# EAGLE design fr5949_v3 (EAGLE 8.1.0)
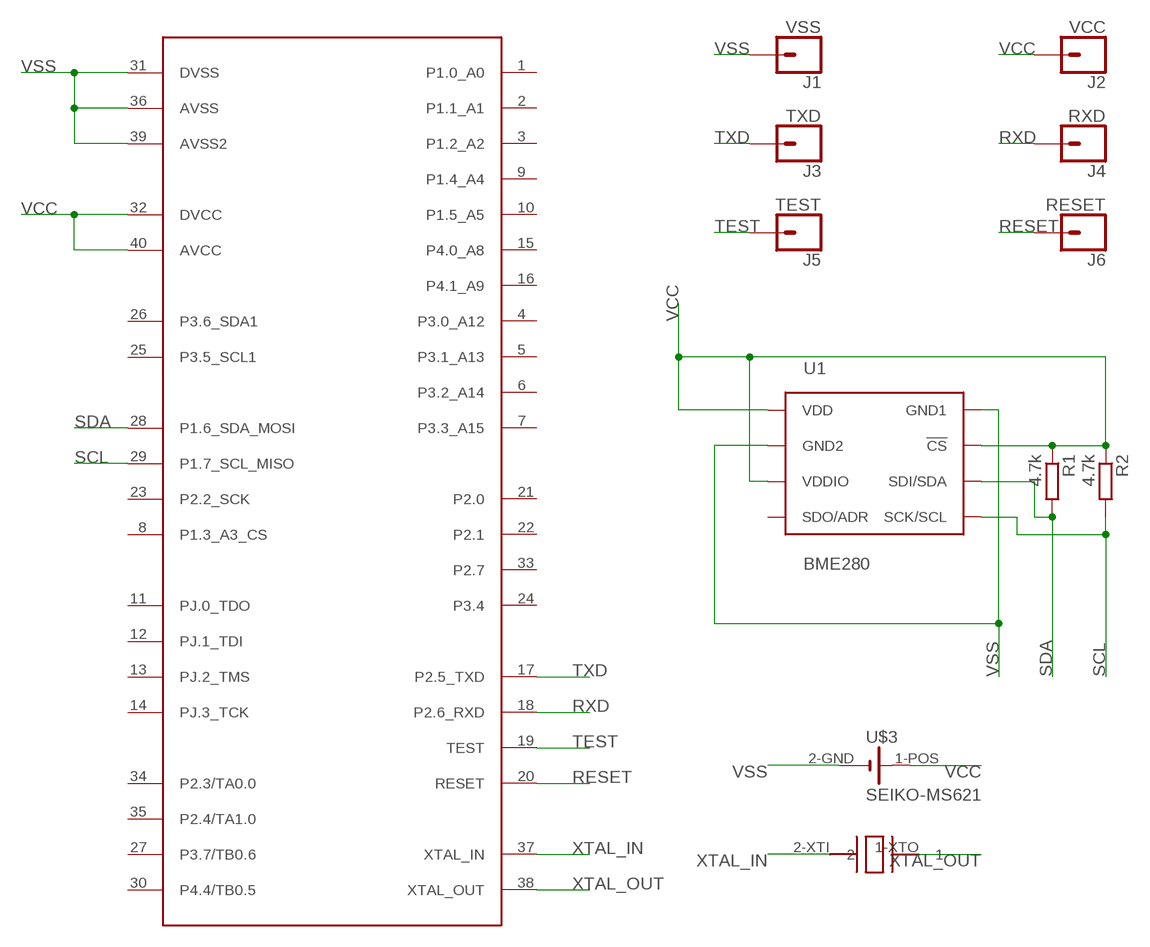
[diagram p0: schematic, sheet 1]

## Parts
J1  VSS  CONN_01  [1X01]
J2  VCC  CONN_01  [1X01]
J3  TXD  CONN_01  [1X01]
J4  RXD  CONN_01  [1X01]
J5  TEST  CONN_01  [1X01]
J6  RESET  CONN_01  [1X01]
R1  4.7k  R-EU_R0201  [R0201]
R2  4.7k  R-EU_R0201  [R0201]
U1  BME280  [BME280_LGA]
U$1  MSP430FR5949_RHA  [RHA-40-VQFN]
U$2  ABS06  [2.0X1.0RTC]
U$3  SEIKO-MS621  [SEIKO_MICRO]

## Nets
RESET: J6.1 U$1.20(RESET)
RXD: J4.1 U$1.18(P2.6_RXD)
SCL: R2.2 U1.P$4(SCK/SCL) U$1.29(P1.7_SCL_MISO)
SDA: R1.2 U1.P$3(SDI/SDA) U$1.28(P1.6_SDA_MOSI)
TEST: J5.1 U$1.19(TEST)
TXD: J3.1 U$1.17(P2.5_TXD)
VCC: J2.1 R1.1 R2.1 U1.P$2(!CS) U1.P$6(VDDIO) U1.P$8(VDD) U$1.32(DVCC) U$1.40(AVCC) U$3.1-POS(+)
VSS: J1.1 U1.P$1(GND1) U1.P$7(GND2) U$1.31(DVSS) U$1.36(AVSS) U$1.39(AVSS2) U$3.2-GND(-)
XTAL_IN: U$1.37(XTAL_IN) U$2.2-XTI
XTAL_OUT: U$1.38(XTAL_OUT) U$2.1-XTO
Unconnected: U1.P$5(SDO/ADR) U$1.1(P1.0_A0) U$1.2(P1.1_A1) U$1.3(P1.2_A2) U$1.4(P3.0_A12) U$1.5(P3.1_A13) U$1.6(P3.2_A14) U$1.7(P3.3_A15) U$1.8(P1.3_A3_CS) U$1.9(P1.4_A4) U$1.10(P1.5_A5) U$1.11(PJ.0_TDO) U$1.12(PJ.1_TDI) U$1.13(PJ.2_TMS) U$1.14(PJ.3_TCK) U$1.15(P4.0_A8) U$1.16(P4.1_A9) U$1.21(P2.0) U$1.22(P2.1) U$1.23(P2.2_SCK) U$1.24(P3.4) U$1.25(P3.5_SCL1) U$1.26(P3.6_SDA1) U$1.27(P3.7/TB0.6) U$1.30(P4.4/TB0.5) U$1.33(P2.7) U$1.34(P2.3/TA0.0) U$1.35(P2.4/TA1.0)

## Library data of the parts
J1-J6 = SparkFun-Connectors:CONN_01: Single connection point. Often used as Generic Header-pin footprint for 0.1 inch spaced/style header connections On any of the 0.1 inch spaced packages, you can populate with these: Break Away Headers - Straight <https://www.sparkfun.com/products/116> (PRT-00116) Break Away Male Headers - Right Angle <https://www.sparkfun.com/products/553> (PRT-00553) Female Headers <https://www.sparkfun.com/products/115> (PRT-00115) Break Away Headers - Machine Pin <https://www.sparkfun.com/products/117> (PRT-00117) Break Away Female Headers - Swiss Machine Pin <https://www.sparkfun.com/products/743> (PRT-00743) This device is also useful as a general connection point to wire up your design to another part of your project. Our various solder wires solder well into these plated through hole pads. Hook-Up Wire - Assortment (Stranded, 22 AWG) <https://www.sparkfun.com/products/11375> (PRT-11375) Hook-Up Wire - Assortment (Solid Core, 22 AWG) <https://www.sparkfun.com/products/11367> (PRT-11367) View the entire wire category on our website here <https://www.sparkfun.com/categories/141> Special notes: SMTSO-256-ET is a "flush mount" nut for a 4-40 screw. We mostly use this on specialty testbeds; it is a nice way to connect hardware to your PCB at an adjustable hieght. Also note, the SNAP packages are for using a snappable style connector. We sell a baggie of snaps and they are also used on two LilyPad designs: Snap Assortment - 30 pack (male and female) <https://www.sparkfun.com/products/11347> (DEV-11347) LilyPad Arduino SimpleSnap <https://www.sparkfun.com/products/10941> (DEV-10941) LilyPad SimpleSnap Protoboard <https://www.sparkfun.com/products/10940> (DEV-10940)
R1 R2 = resistor:R-EU_: RESISTOR, European symbol
U1 = BME280ComponentLibrary:BME280; PROD_ID: IC-13090
U$1 = chips:MSP430FR5949_RHA
U$2 = abracon:ABS06
U$3 = battery:SEIKO-MS621

## Board
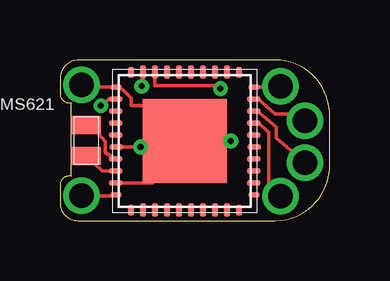
[diagram p1: board, top side]
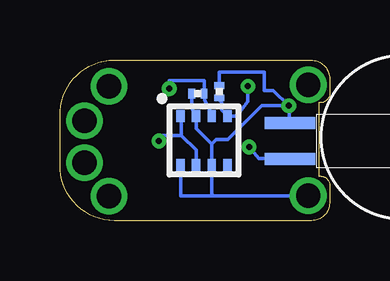
[diagram p2: board, bottom side, seen from below]

Size 11.23 x 6.72 mm. Coordinates in mm from the lower left corner, seen from the top.
Outline: 0,1.54 0,0.74 arc90 0.74,0.01 8.75,0.01 arc90 11.23,2.13 11.23,4.58 arc90 8.78,6.71 0.76,6.71 arc90 0,5.92 0,5.25 arc90 0.45,4.93 0.46,4.93 0.46,1.86 0.45,1.86 arc90 0,1.54
Copper layers (1*16): Top 0.0356mm / dielectric 1.5011mm / Bottom 0.0356mm
Design rules "LaenPCBOrder *": minimum track width 6mil, minimum drill 13mil, track to track 6mil, track to pad 6mil, pad to pad 6mil, via to via 6mil, smd to smd 6mil, copper to edge 15mil, drill to drill 6mil, minimum pad ring 7mil, minimum via ring 7mil, stop-mask expansion 2mil, vias tented up to drill 14mil, thermal gap 10mil

### Footprints (pad centres in the part's own frame; a part is rotated, then mirrored left to right if it is on the bottom)
1X01 = drill 1.016 pad 1.27: 1 0,0
R0201 = smd 0.28 x 0.43: 1 -0.255,0; 2 0.255,0
BME280_LGA = smd 0.5 x 0.35: P$1 1.025,0.975; P$2 1.025,0.325; P$3 1.025,-0.325; P$4 1.025,-0.975; P$5 -1.025,-0.975; P$6 -1.025,-0.325; P$7 -1.025,0.325; P$8 -1.025,0.975
RHA-40-VQFN = smd 0.23 x 0.45: 1 -2.25,-2.88; 10 2.25,-2.88; 21 2.25,2.87; 30 -2.25,2.87 | smd 0.23 x 0.55: 2 -1.75,-2.88; 3 -1.25,-2.88; 4 -0.75,-2.88; 5 -0.25,-2.88; 6 0.25,-2.87; 7 0.75,-2.88; 8 1.25,-2.88; 9 1.75,-2.88; 22 1.75,2.87; 23 1.25,2.87; 24 0.75,2.87; 25 0.25,2.88; 26 -0.25,2.87; 27 -0.75,2.87; 28 -1.25,2.87; 29 -1.75,2.87 | smd 0.45 x 0.23: 11 2.87,-2.25; 20 2.87,2.25; 31 -2.88,2.25; 40 -2.88,-2.25 | smd 0.55 x 0.23: 12 2.87,-1.75; 13 2.87,-1.25; 14 2.87,-0.75; 15 2.88,-0.25; 16 2.87,0.25; 17 2.87,0.75; 18 2.87,1.25; 19 2.87,1.75; 32 -2.88,1.75; 33 -2.88,1.25; 34 -2.88,0.75; 35 -2.88,0.25; 36 -2.87,-0.25; 37 -2.88,-0.75; 38 -2.88,-1.25; 39 -2.88,-1.75 | smd 3.5 x 3.5: PAD 0,0
2.0X1.0RTC = smd 0.75 x 1.2: 1-XTO -0.65,0; 2-XTI 0.65,0
SEIKO_MICRO = smd 2.1 x 0.5 bottom: 1-POS 0,0.75; 2-GND 0,-0.75

### Placement (x,y rotation side)
J1  0.89,5.67 0 top
J2  0.89,1.05 0 top
J3  9.19,1.02 0 top
J4  10.21,2.42 0 top
J5  10.21,4.17 0 top
J6  9.19,5.62 0 top
R1  5.49,5.32 0 bottom
R2  4.6,5.39 270 bottom
U1  5.23,3.36 90 bottom
U$1  5.21,3.33 0 top
U$2  1.09,3.36 90 top
U$3  1.65,3.33 0 top

### Tracks (layer width: path | path; a pad name or v marks a point on that pad's centre or on a via)
RESET
  Top 0.152: U$1.20 9.02,5.58 J6.1
RXD
  Top 0.152: U$1.18 8.2,4.61 9.02,3.92 9.02,3.46 J4.1
SCL  (via drill 0.25 pad 0.33)
  Top 0.152: U$1.29 3.46,5.8 v3.4,5.62
  Bottom 0.152: R2.2 4.7,5.14 4.5,4.93 4.5,4.62 U1.P$4 3.88,4.38 3.4,4.98 v3.4,5.62
SDA  (via drill 0.25 pad 0.33)
  Top 0.152: U$1.28 3.96,5.64 6.73,5.64 6.73,5.57 v6.68,5.52
  Bottom 0.152: U1.P$3 4.91,4.43 5.21,5.04 5.21,5.29 R1.2 5.23,5.85 6.68,5.85 v6.68,5.52
TEST
  Top 0.152: U$1.19 8.23,5.11 8.97,4.45 9.6,4.45 J5.1
TXD
  Top 0.152: U$1.17 8.13,4.05 8.28,4.08 8.7,3.69 8.7,1.52 J3.1
VCC  (via drill 0.25 pad 0.33)
  Top 0.152: U$1.40 2.34,1.05 J2.1 | U$1.32 2.03,5.08 1.83,4.88 1.83,4.83 v1.7,4.81
  Bottom 0.152: v1.7,4.81 1.68,4.21 U$3.1-POS | J2.1 4.83,1.05 | 4.9,3.21 5.56,3.86 U1.P$2 arc45 5.74,4.83 R1.1 5.77,5.24 | 4.9,3.21 U1.P$6 4.91,1.13 4.83,1.05 | 4.9,3.21 4.72,3.38 4.24,3.38 2.82,4.81 v1.7,4.81 | R2.1 4.6,6.2 2.72,6.2 2.72,5.45 2.34,5.45 v1.7,4.81 | 4.83,1.05 6.21,1.05 U1.P$8
VSS  (via drill 0.25 pad 0.33)
  Top 0.152: J1.1 1.36,5.58 U$1.31 | U$1.36 2.39,3.08 v3.35,3.08 3.45,3.33 3.86,3.33 | 2.47,5.58 U$1.31 | 7.39,3.28 v7.11,3.33 3.86,3.33 | U$1.31 2.61,5.48 2.97,5.12 2.97,4.81 3.86,4.81 3.86,3.33 | 3.86,3.33 3.86,1.58 U$1.39
  Bottom 0.152: 6.17,3.56 5.56,2.95 U1.P$7 | 6.17,3.56 6.17,4.35 U1.P$1 | v7.11,3.33 7.11,3.56 6.17,3.56 | U$3.2-GND 1.65,2.6 2.95,2.6 v3.35,3.08 | 0.94,5.95 J1.1
XTAL_IN
  Top 0.152: U$1.37 1.88,2.85 1.88,3.31 1.31,3.98 U$2.2-XTI
XTAL_OUT
  Top 0.152: U$1.38 1.77,2.08 U$2.1-XTO